# EAGLE schematic opamp_usrx (EAGLE 6.4)
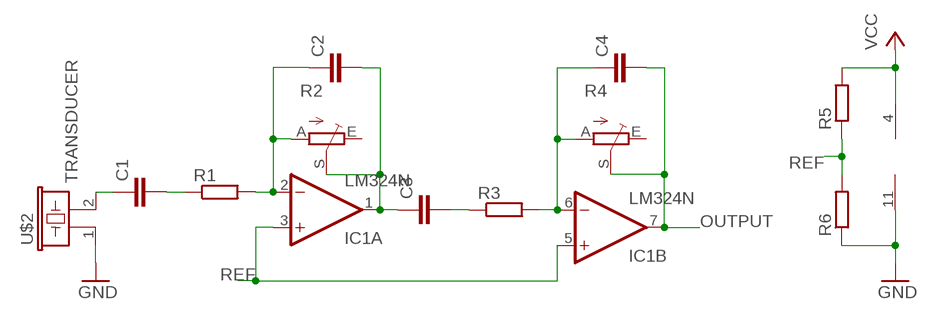
[diagram p0: schematic, sheet 1]

## Parts
C1  C-EU025-025X050  [C025-025X050]
C2  C-EU025-025X050  [C025-025X050]
C3  C-EU025-025X050  [C025-025X050]
C4  C-EU025-025X050  [C025-025X050]
IC1  LM324N  [DIL14]
R1  R-EU_0207/2V  [0207/2V]
R2  TRIM_EU-S63P  [S63P]
R3  R-EU_0207/2V  [0207/2V]
R4  TRIM_EU-S63P  [S63P]
R5  R-EU_0207/2V  [0207/2V]
R6  R-EU_0207/2V  [0207/2V]
U$2  TRANSDUCER  [TRANSDUCER]

## Nets
GND: IC1.11(P:V-) R6.1 U$2.1
N$1: C2.1 IC1.2(A:-IN) R1.2 R2.A
N$2: C1.2 R1.1
N$3: C2.2 C3.1 IC1.1(A:OUT) R2.S
N$5: C3.2 R3.1
N$6: C4.1 IC1.6(B:-IN) R3.2 R4.A
N$9: C1.1 U$2.2
OUTPUT: C4.2 IC1.7(B:OUT) R4.S
REF: IC1.3(A:+IN) IC1.5(B:+IN) R5.1 R6.2
VCC: IC1.4(P:V+) R5.2
Unconnected: IC1.8(C:OUT) IC1.9(C:-IN) IC1.10(C:+IN) IC1.12(D:+IN) IC1.13(D:-IN) IC1.14(D:OUT) R2.E R4.E

## Library data of the parts
C1-C4 = rcl:C-EU: CAPACITOR, European symbol
IC1 = linear:LM324: OP AMP
R1 R3 R5 R6 = rcl:R-EU_: RESISTOR, European symbol
R2 R4 = pot:TRIM_EU-: POTENTIOMETER
U$2 = Ultrasound:TRANSDUCER